# Altium schematic sheet MAIN_SCH.SchDoc
size A4
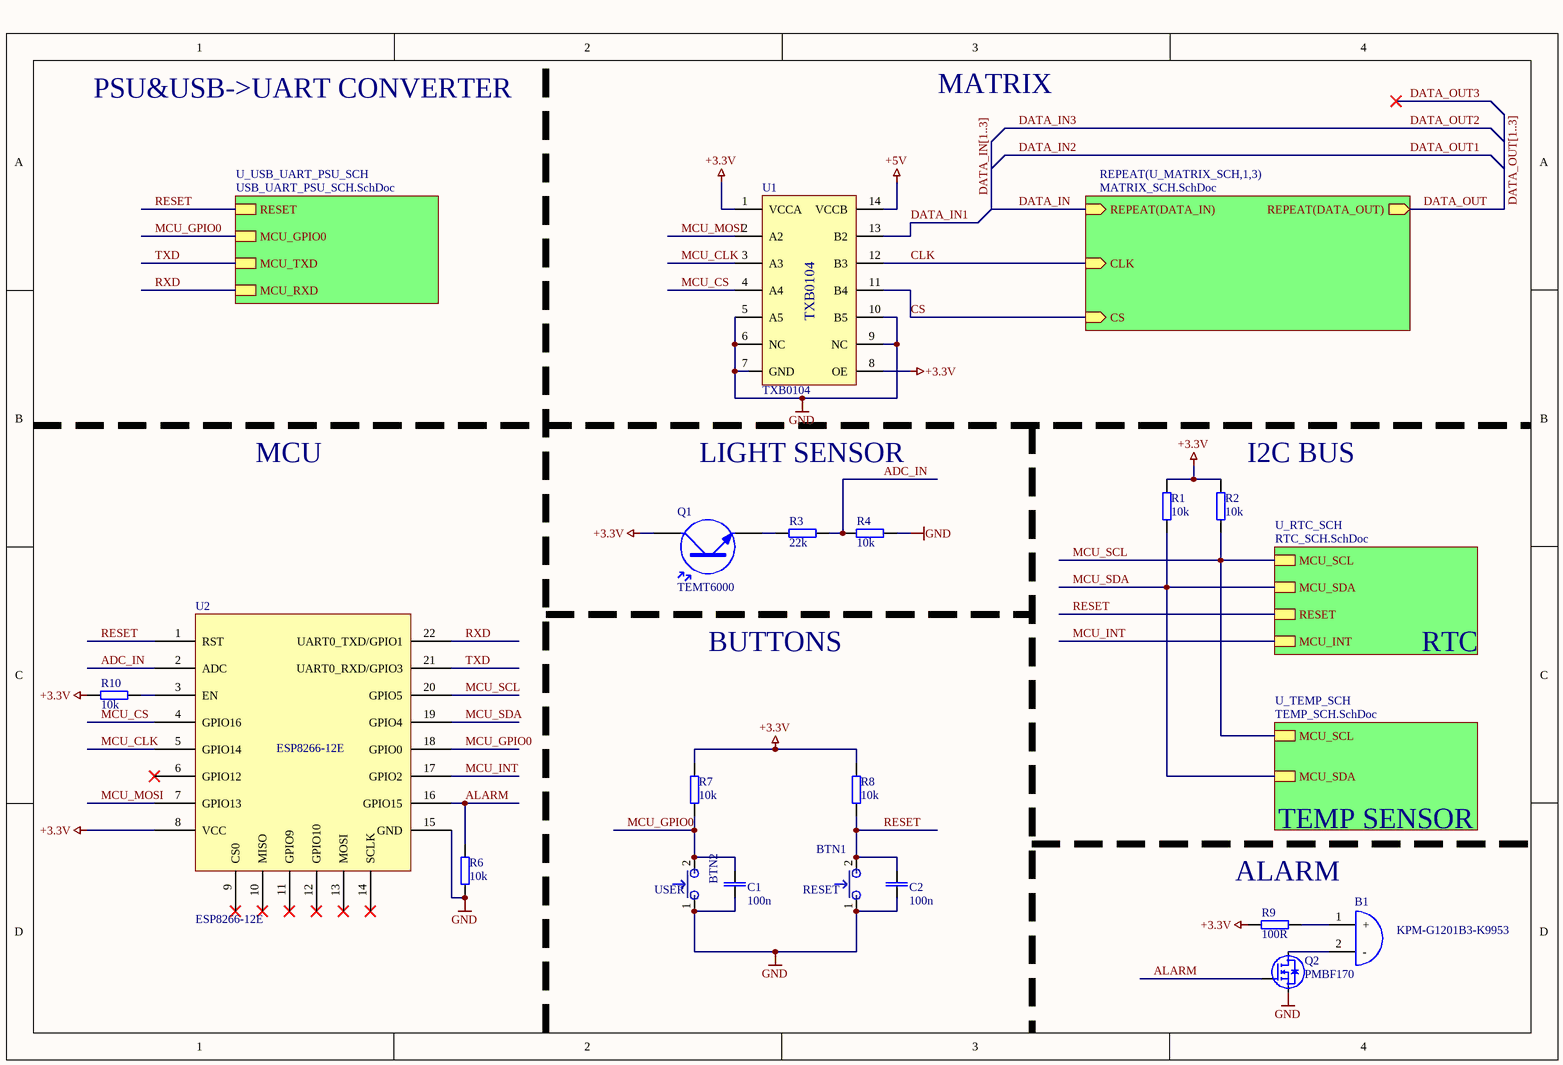
[diagram p0: MAIN_SCH.SchDoc]

## Parts
B1  KPM-G1201B3-K9953  [KPM-G1201B3-K9953]
BTN1  USER  [PBUTTON_SMD]
BTN2  RESET  [PBUTTON_SMD]
C1  100n  [CAP 0805]
C2  100n  [CAP 0805]
Q1  TEMT6000  [TEMT600]
Q2  PMBF170  [SOT23]
R1  10k  [RES 0805]
R2  10k  [RES 0805]
R3  22k  [RES 0805]
R4  10k  [RES 0805]
R6  10k  [RES 0805]
R7  10k  [RES 0805]
R8  10k  [RES 0805]
R9  100R  [RES 0805]
R10  10k  [RES 0805]
U1  TXB0104  [SO14]
U2  ESP8266-12E  [ESP8266-12E]

## Sub-sheets
REPEAT(U_MATRIX_SCH,1,3) = MATRIX_SCH.SchDoc: REPEAT(DATA_IN) (in), CLK (in), CS (in), REPEAT(DATA_OUT) (out)
U_RTC_SCH = RTC_SCH.SchDoc: MCU_SDA, MCU_SCL, MCU_INT, RESET
U_TEMP_SCH = TEMP_SCH.SchDoc: MCU_SDA, MCU_SCL
U_USB_UART_PSU_SCH = USB_UART_PSU_SCH.SchDoc: MCU_RXD, MCU_TXD, RESET, MCU_GPIO0

## Nets
+3.3V: Q1.1(C) R1.2 R2.2 R7.2 R8.2 R9.1 R10.2 U1.1(VCCA) U1.8(OE) U2.8(VCC)
+5V: U1.14(VCCB)
GND: BTN1.1 BTN2.1 C1.1 C2.1 Q2.2(S) R4.2 R6.1 U1.5(A5) U1.6(NC) U1.7(GND) U1.9(NC) U1.10(B5) U2.15(GND)
ADC_IN: R3.2 R4.1 U2.2(ADC)
ALARM: Q2.1(G) R6.2 U2.16(GPIO15)
CLK: U1.12(B3) ; sheet REPEAT(U_MATRIX_SCH,1,3)/CLK
CS: U1.11(B4) ; sheet REPEAT(U_MATRIX_SCH,1,3)/CS
DATA_IN: sheet REPEAT(U_MATRIX_SCH,1,3)/REPEAT(DATA_IN)
DATA_IN1: U1.13(B2)
DATA_OUT: sheet REPEAT(U_MATRIX_SCH,1,3)/REPEAT(DATA_OUT)
MCU_CLK: U1.3(A3) U2.5(GPIO14)
MCU_CS: U1.4(A4) U2.4(GPIO16)
MCU_GPIO0: BTN2.2 C1.2 R7.1 U2.18(GPIO0) ; sheet U_USB_UART_PSU_SCH/MCU_GPIO0
MCU_INT: U2.17(GPIO2) ; sheet U_RTC_SCH/MCU_INT
MCU_MOSI: U1.2(A2) U2.7(GPIO13)
MCU_SCL: R2.1 U2.20(GPIO5) ; sheet U_RTC_SCH/MCU_SCL, sheet U_TEMP_SCH/MCU_SCL
MCU_SDA: R1.1 U2.19(GPIO4) ; sheet U_RTC_SCH/MCU_SDA, sheet U_TEMP_SCH/MCU_SDA
RESET: BTN1.2 C2.2 R8.1 U2.1(RST) ; sheet U_RTC_SCH/RESET, sheet U_USB_UART_PSU_SCH/RESET
RXD: U2.22(UART0_TXD/GPIO1) ; sheet U_USB_UART_PSU_SCH/MCU_RXD
TXD: U2.21(UART0_RXD/GPIO3) ; sheet U_USB_UART_PSU_SCH/MCU_TXD
NetB1_1: B1.1(+) R9.2
NetB1_2: B1.2(-) Q2.3(D)
NetQ1_2: Q1.2(E) R3.1
NetR10_1: R10.1 U2.3(EN)

Not connected (* = marked no-connect by the designer): U2 6(GPIO12)* 9(CS0)* 10(MISO)* 11(GPIO9)* 12(GPIO10)* 13(MOSI)* 14(SCLK)*

## Buses and harness runs
bus DATA_IN[1..3]
bus DATA_OUT[1..3]

## Notes on the sheet
- PSU&USB->UART CONVERTER
- MATRIX
- MCU
- LIGHT SENSOR
- (near R2) I2C BUS
- BUTTONS
- RTC
- TEMP SENSOR
- ALARM

## Library data of the parts
B1 = BUZZER: Supplier: Lomex; Reference: 46-02-70; VALUE: KPM-G1201B3-K9953
BTN1 BTN2 = PUSHBUTTON: Tactile push button; Reference: 45-05-43; Supplier: Lomex
  BTN1: VALUE: USER
  BTN2: VALUE: RESET
C1 C2 = CAP: NON POLARIZED CAPACITOR; VALUE: 100n; Reference: 82-10-76; Supplier: Lomex
Q1 = TEMT6000: Light sensor; Reference: *; Supplier: *; VALUE: TEMT6000
Q2 = PMBF170: N-Channel MOSFET; Reference: 86-01-96; VALUE: PMBF170; Supplier: Lomex
R1-R4 R6-R10 = RES: RESISTOR; Supplier: Lomex
  R1 R2 R4 R6-R8 R10: Reference: 81-10-99; VALUE: 10k
  R3: Reference: 81-11-03; VALUE: 22k
  R9: Reference: 81-30-00; VALUE: 100R
U1 = TXB0104: Voltage level shifter; Reference: 2539993; Supplier: Farnell; VALUE: TXB0104
U2 = ESP8266-12E: WiFi module; Reference: *; Supplier: *; VALUE: *